# EAGLE design SSCI_SPI_LCD (EAGLE 7.5.0)
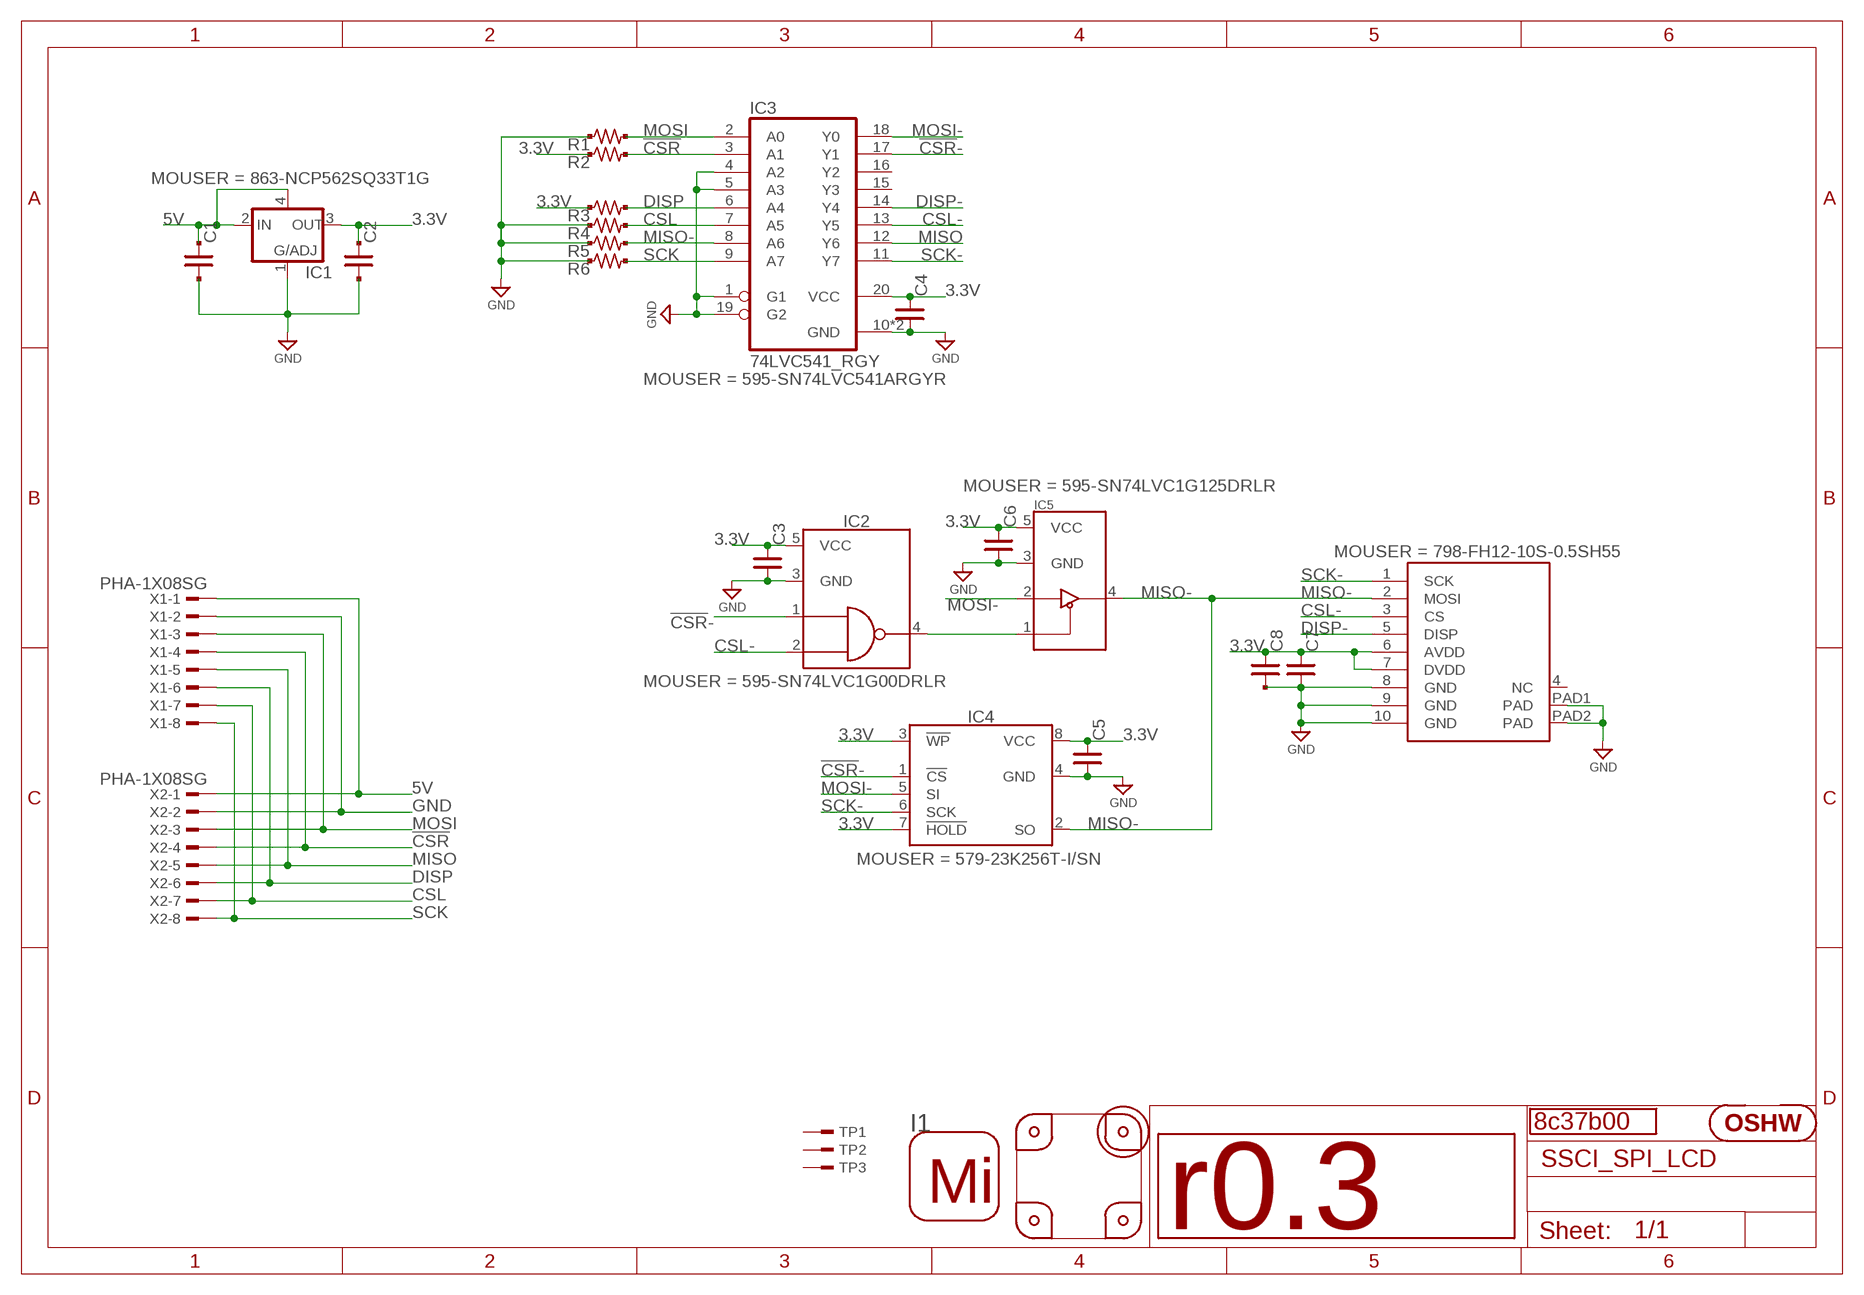
[diagram p0: schematic, sheet 1]

## Parts
C1  C_SMD_10U_1608  [CR_1608]
C2  C_SMD_10U_1608  [CR_1608]
C3  C_SMD_0.1U_1005  [C0402]
C4  C_SMD_0.1U_1005  [C0402]
C5  C_SMD_0.1U_1005  [C0402]
C6  C_SMD_0.1U_1005  [C0402]
C7  C_SMD_0.1U_1005  [C0402]
C8  C_SMD_0.1U_1005  [C0402]
GIT1  8c37b00  GIT-REVISION_1.2  [GIT-REVISION_1.2]
I1  ICON_MINLAB_5.2S  [ICON_MINLAB_5.2MM]
IC1  LDO4_3.3_SC82-AB  [SOT130P220X135-4N]
IC2  74LVC1G00_DRL  [SOT50P160X120-5N]
IC3  74LVC541_RGY  [QFN50P460X360-20N]
IC4  IC_MEMORY_8P_23K256-I_SOP  [IC_08_1.27_150MIL]
IC5  74LVC1G125_DRL  [SOT50P160X120-5N]
ICON1  r0.3  ICON_REVISION_1.7  [ICON_REVISION1.7]
ICON2  ICON_OSHW  [ICON_OSHW]
LCD1  LCD_GLCD_400X240  [LCD_GLCD_400X240]
P1  PCB_CORNER_NH  [PCB_CORNER_NH]
P2  PCB_CORNER_NH  [PCB_CORNER_NH]
P3  PCB_CORNER_NH  [PCB_CORNER_NH]
P4  PCB_CORNER_NH  [PCB_CORNER_NH]
R1  R_US_10K_1005  [C0402]
R2  R_US_10K_1005  [C0402]
R3  R_US_10K_1005  [C0402]
R4  R_US_10K_1005  [C0402]
R5  R_US_10K_1005  [C0402]
R6  R_US_10K_1005  [C0402]
TP1  TESTPAD_F  [FIDUCIAL]
TP2  TESTPAD_F  [FIDUCIAL]
TP3  TESTPAD_F  [FIDUCIAL]
X1  PHA-1X08SG  [PHA-1X08SG]
X2  PHA-1X08SG  [PHA-1X08SG]

## Nets
3.3V: C2.1 C3.1 C4.1 C5.1 C6.1 C7.1 C8.1 IC1.3(OUT) IC2.5(VCC) IC3.20(VCC) IC4.3(!WP) IC4.7(!HOLD) IC4.8(VCC) IC5.5(VCC) LCD1.6(AVDD) LCD1.7(DVDD) R2.1 R3.1
5V: C1.1 IC1.2(IN) IC1.4(OUT/EN/NC) X1.1 X2.1
!CSR!: IC3.3(A1) R2.2 X1.4 X2.4
!CSR!-: IC2.1(1A) IC3.17(Y1) IC4.1(!CS)
CSL: IC3.7(A5) R4.2 X1.7 X2.7
CSL-: IC2.2(1B) IC3.13(Y5) LCD1.3(CS)
DISP: IC3.6(A4) R3.2 X1.6 X2.6
DISP-: IC3.14(Y4) LCD1.5(DISP)
GND: C1.2 C2.2 C3.2 C4.2 C5.2 C6.2 C7.2 C8.2 IC1.1(ADJ) IC2.3(GND) IC3.1(G1) IC3.4(A2) IC3.5(A3) IC3.10(GND) IC3.19(G2) IC3.EP(GND) IC4.4(GND) IC5.3(GND) LCD1.8(GND) LCD1.9(GND) LCD1.10(GND) LCD1.PAD1(PAD) LCD1.PAD2(PAD) R1.1 R4.1 R5.1 R6.1 X1.2 X2.2
MISO: IC3.12(Y6) X1.5 X2.5
MISO-: IC3.8(A6) IC4.2(SO) IC5.4(Y) LCD1.2(MOSI) R5.2
MOSI: IC3.2(A0) R1.2 X1.3 X2.3
MOSI-: IC3.18(Y0) IC4.5(SI) IC5.2(A)
N$2: IC2.4(1Y) IC5.1(!OE!)
SCK: IC3.9(A7) R6.2 X1.8 X2.8
SCK-: IC3.11(Y7) IC4.6(SCK) LCD1.1(SCK)
Unconnected: IC3.15(Y3) IC3.16(Y2) LCD1.4(NC) TP1.TP TP2.TP TP3.TP

## Library data of the parts
C1 C2 = mylib:C_SMD_*: SMD CAPACITOR; DIGIKEY: 445-11238-1-ND; SMD_PAD: 2
C3-C8 = mylib:C_SMD_*: SMD CAPACITOR; DIGIKEY: 490-3261-1-ND; SEEED: 302010024; SMD_PAD: 2
GIT1 = git-revision:GIT-REVISION; NOT_COMPONENT: YES
I1 = mylib:ICON_MINLAB; NOT_COMPONENT: YES
IC1 = mylib:LDO4_*: LDO with 4 pins; MOUSER: 863-NCP562SQ33T1G
IC2 = mylib:74*1G00: SINGLE 2-INPUT POSITIVE-OR GATE; MOUSER: 595-SN74LVC1G00DRLR
IC3 = mylib:74*541; MOUSER: 595-SN74LVC541ARGYR
IC4 = mylib:IC_MEMORY_8P_*; DIGIKEY: 23K256T-I/SNCT-ND; MOUSER: 579-23K256T-I/SN
IC5 = mylib:74*1G125: SINGLE BUS BUFFER GATE w/ 3-State Output; MOUSER: 595-SN74LVC1G125DRLR
ICON1 = mylib:ICON_REVISION; NOT_COMPONENT: YES
ICON2 = mylib:ICON_OSHW: Silk icon of OSHW; NOT_COMPONENT: YES
LCD1 = mylib:LCD_GLCD_400X240; DIGIKEY: HFJ110CT-ND; MOUSER: 798-FH12-10S-0.5SH55
P1-P4 = mylib:PCB_CORNER; NOT_COMPONENT: YES
R1 = mylib:R_US_*: SMD resistor Packages : _1608 : 1.6 x 0.8 mm _2125 : 2.0 x 1.25 mm _3216 : 3.2 x 1.6 mm; DIGIKEY: P10.0KLCT-ND; NOT_COMPONENT: YES; SEEED: 301010047; SMD_PAD: 2
R2-R6 = mylib:R_US_*: SMD resistor Packages : _1608 : 1.6 x 0.8 mm _2125 : 2.0 x 1.25 mm _3216 : 3.2 x 1.6 mm; DIGIKEY: P10.0KLCT-ND; SEEED: 301010047; SMD_PAD: 2
TP1-TP3 = mylib:TESTPAD: test points; NOT_COMPONENT: YES
X1 X2 = mylib:PHA-1X08*G; AKIZUKI: C-04394

## Board
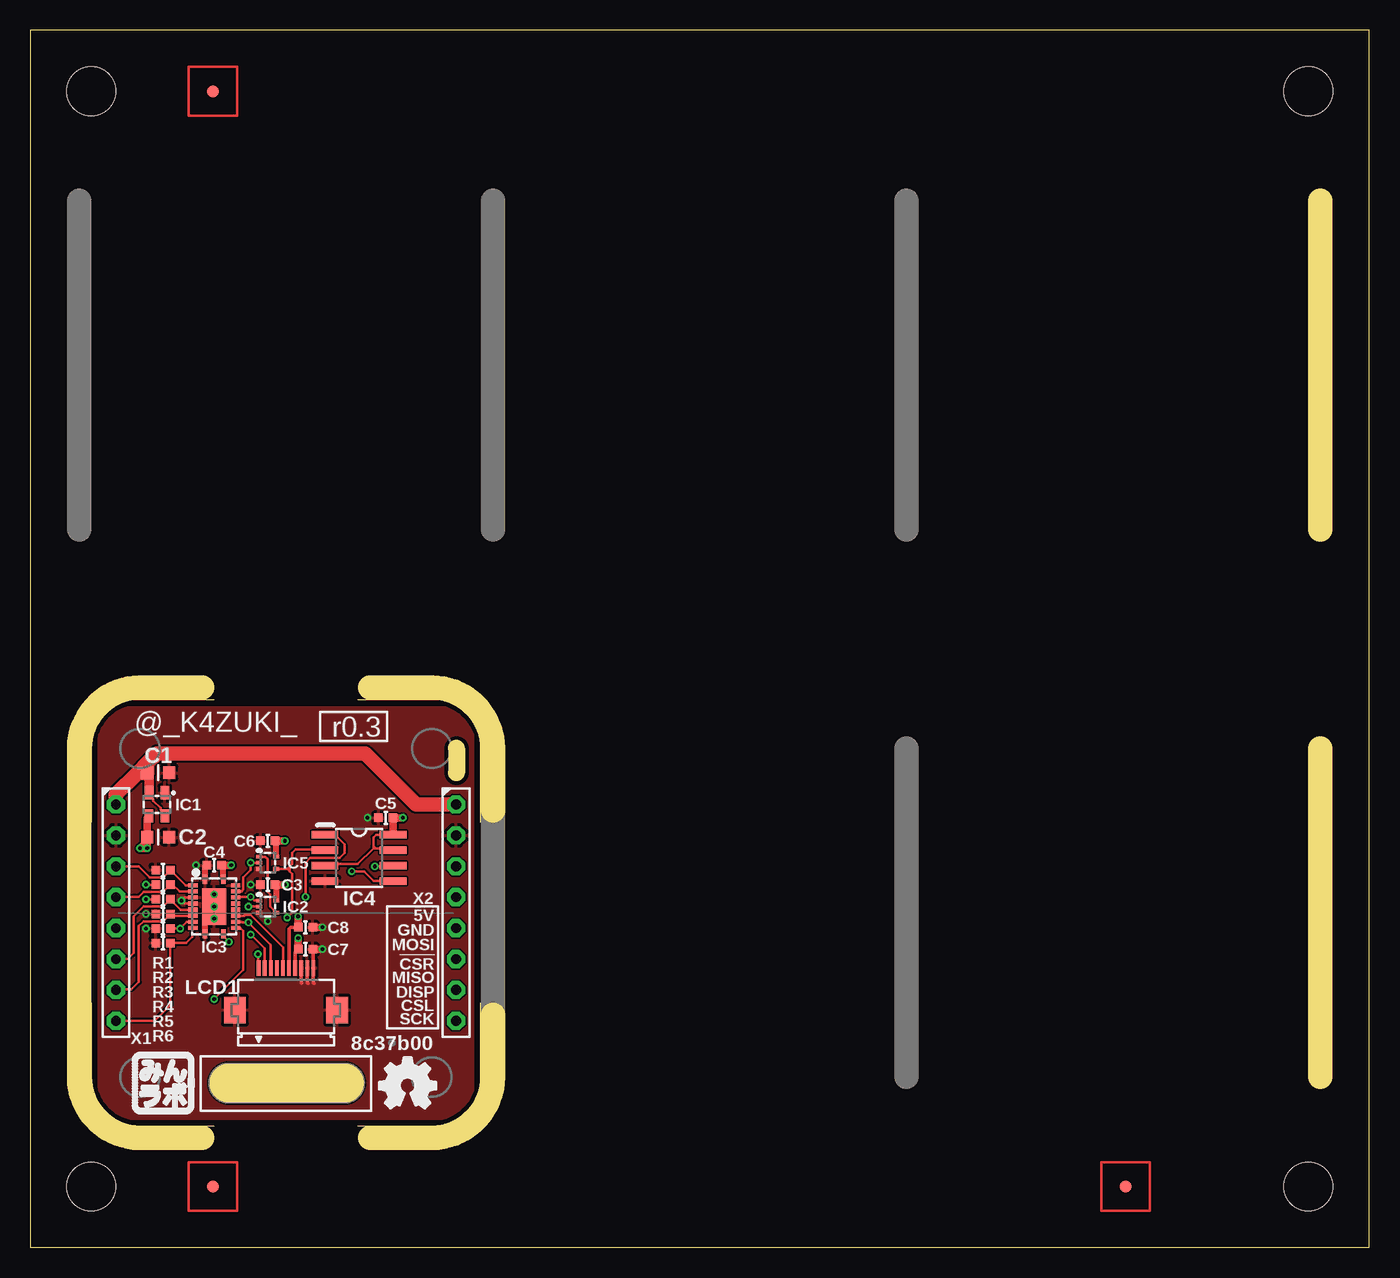
[diagram p1: board, top side]
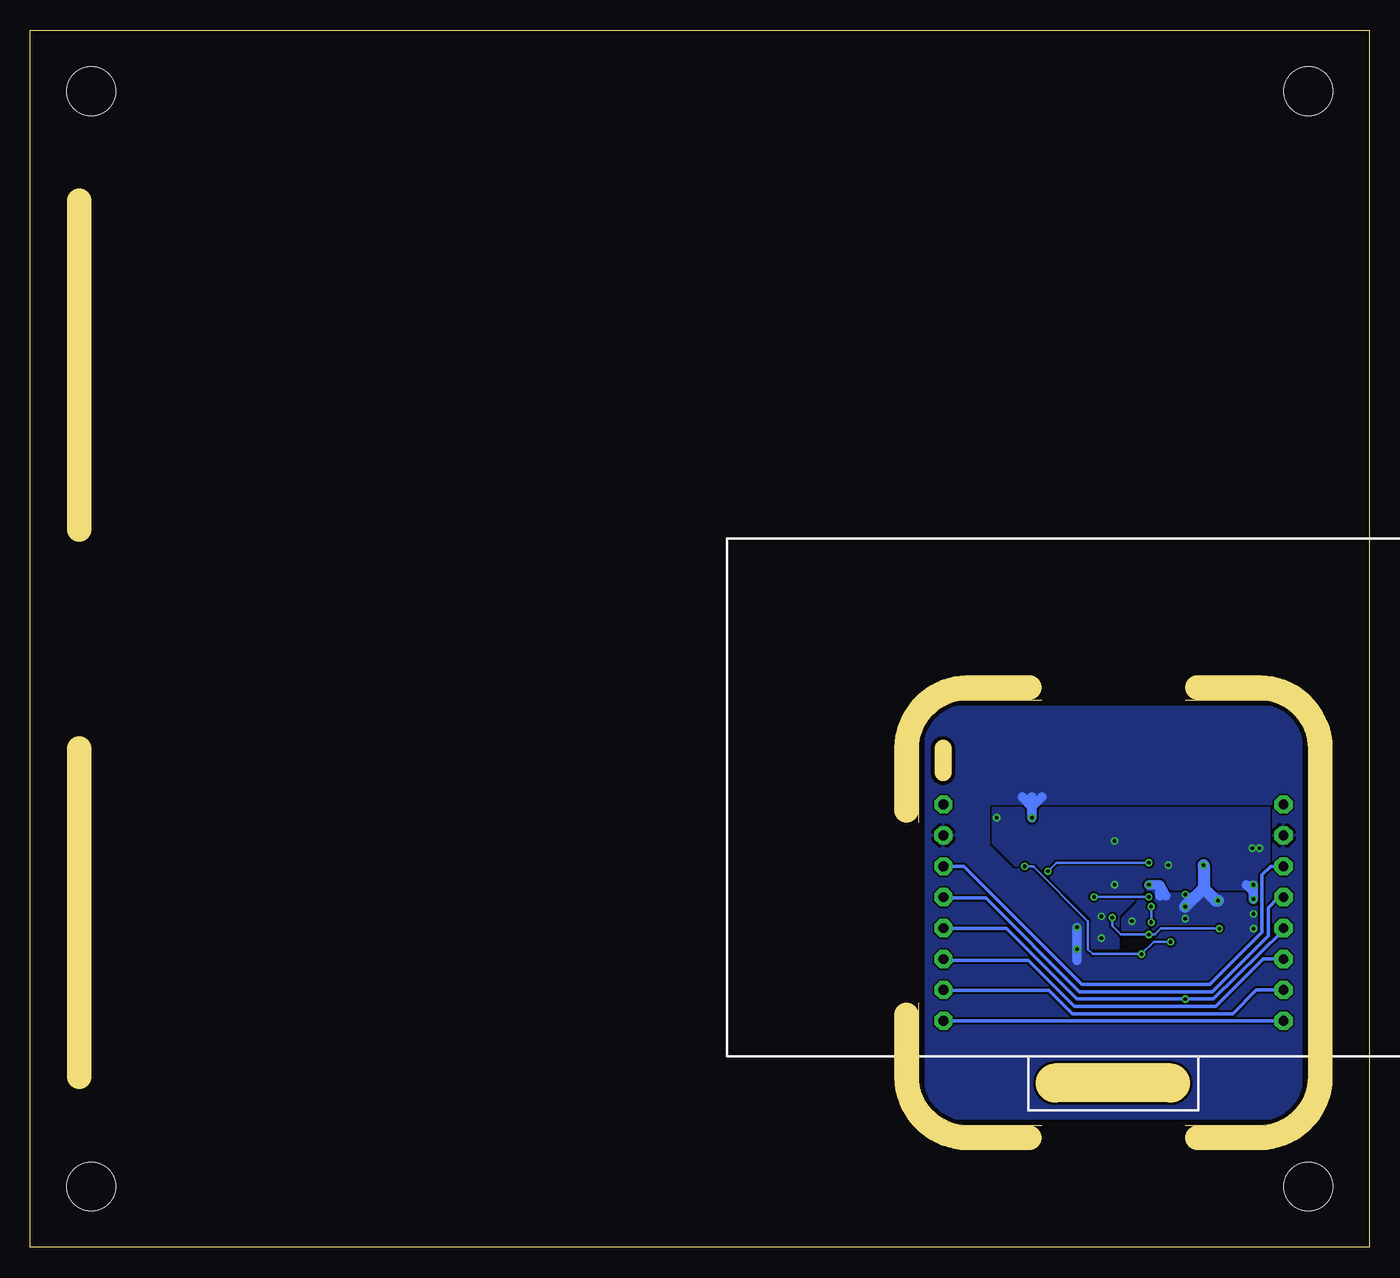
[diagram p2: board, bottom side, seen from below]

Size 110 x 100 mm. Coordinates in mm from the lower left corner, seen from the top.
Outline: 0,0 110,0 110,100 0,100 0,0
Copper layers (1*16): Top 0.035mm / dielectric 1.5mm / Bottom 0.035mm
Design rules "default": minimum track width 0.15mm, minimum drill 0.3mm, track to track 0.15mm, track to pad 0.15mm, pad to pad 0.15mm, via to via 0.15mm, smd to smd 0mil, copper to edge 0.4mm, drill to drill 8mil, minimum pad ring 0.15mm, minimum via ring 0.15mm, stop-mask expansion 4mil, vias tented up to drill 100mil, thermal gap 10mil
Holes 4 mm at 5,5 105,5 105,95 5,95
tRestrict: 18 lines
bRestrict: 5 lines
Milling: 4 lines

### Footprints (pad centres in the part's own frame; a part is rotated, then mirrored left to right if it is on the bottom)
CR_1608 = smd 1 x 1: 1 -0.9,0; 2 0.9,0
C0402 = smd 0.7 x 0.7: 1 -0.6,0; 2 0.6,0
SOT130P220X135-4N = smd 0.7 x 1.1: 1 -0.65,-0.95; 2 0.65,-0.95; 3 0.65,0.95; 4 -0.65,0.95
SOT50P160X120-5N = smd 0.3 x 0.5: 1 -0.5,-0.7; 2 0,-0.7; 3 0.5,-0.7; 4 0.5,0.7; 5 -0.5,0.7
QFN50P460X360-20N = smd 0.75 x 0.35: 1 -2.25,-0.75; 10 2.25,-0.75; 11 2.25,0.75; 20 -2.25,0.75 | smd 0.35 x 0.75: 2 -1.75,-1.75; 3 -1.25,-1.75; 4 -0.75,-1.75; 5 -0.25,-1.75; 6 0.25,-1.75; 7 0.75,-1.75; 8 1.25,-1.75; 9 1.75,-1.75; 12 1.75,1.75; 13 1.25,1.75; 14 0.75,1.75; 15 0.25,1.75; 16 -0.25,1.75; 17 -0.75,1.75; 18 -1.25,1.75; 19 -1.75,1.75 | smd 3 x 2: EP 0,0
IC_08_1.27_150MIL = smd 0.6 x 2.2: 1 -1.905,-2.8; 2 -0.635,-2.8; 3 0.635,-2.8; 4 1.905,-2.8; 5 1.905,2.8; 6 0.635,2.8; 7 -0.635,2.8 | smd 0.603 x 2.2: 8 -1.905,2.8
LCD_GLCD_400X240 = smd 0.3 x 1.3: 1 -2.25,3.45; 2 -1.75,3.45; 3 -1.25,3.45; 4 -0.75,3.45; 5 -0.25,3.45; 6 0.25,3.45; 7 0.75,3.45; 8 1.25,3.45; 9 1.75,3.45; 10 2.25,3.45 | smd 1.8 x 2.2: PAD1 4.2,0; PAD2 -4.2,0
FIDUCIAL = smd 1 x 1: TP 0,0
PHA-1X08SG = drill 0.8 pad 1.5 octagon: 1 8.89,0; 2 6.35,0; 3 3.81,0; 4 1.27,0; 5 -1.27,0; 6 -3.81,0; 7 -6.35,0; 8 -8.89,0

### Placement (x,y rotation side)
C1  10.5,39 0 top
C2  10.5,33.7 0 top
C3  19.5,29.8 180 top
C4  15.1,31.4 180 top
C5  29.2,35.3 180 top
C6  19.5,33.4 180 top
C7  22.6,24.5 0 top
C8  22.6,26.3 0 top
GIT1  29.7,16.8 0 top
I1  8.4,11 0 top
IC1  10.4,36.4 180 top
IC2  19.5,28 270 top
IC3  15.1,28 270 top
IC4  27,32 270 top
IC5  19.5,31.6 270 top
ICON1  26.9,42.8 0 top
ICON2  31,13.3 0 top
LCD1  21,19.5 0 top
P1  33,14 0 top
P2  33,41 90 top
P3  9,41 180 top
P4  9,14 270 top
R1  10.9,31 0 top
R2  10.9,29.8 0 top
R3  10.9,28.6 0 top
R4  10.9,27.4 0 top
R5  10.9,26.2 0 top
R6  10.9,25 0 top
TP1  15,5 0 top
TP2  90,5 0 top
TP3  15,95 0 top
X1  7.03,27.5 90 top
X2  34.97,27.5 90 top

### Tracks (layer width: path | path; a pad name or v marks a point on that pad's centre or on a via)
3.3V  (via drill 0.3)
  Top 0.2: 20.2,28.6 IC2.5 | 20.2,32.2 IC5.5 | IC4.7 28.96,32.63 28.8,32.8 28.4,32.8 | 28.4,32.8 28.2,32.8 | IC4.3 25.07,31.36 25.2,31.5 26.9,31.5 28.2,32.8 | IC4.8 28.41,33.91 28.2,33.7 28.2,33 | 28.2,33 28.2,32.8 | R2.1 v9.5,29.8 | 28.2,33 28.4,32.8 | v9.5,28.6 R3.1
  Top 0.3: LCD1.6 21.25,26.15 21.4,26.3 C8.1 | LCD1.7 21.75,24.25 C7.1
  Top 0.5: C3.1 20.2,29.7 20.2,28.6 | 20.2,32.2 20.2,33.3 C6.1 | IC3.20 15.85,31.25 C4.1
  Top 0.6: IC4.8 C5.1 v30.6,35.3 | v22,25.4 C7.1 | v22,27.2 C8.1 | v20.9,29.8 C3.1 | C6.1 v20.9,33.4 | C4.1 v16.5,31.4 | IC1.3 9.6,35.3 C2.1 9.6,33.4 | 9.6,33.4 v9.6,32.8 v9,32.8 9.6,33.4
  Bottom 0.8: v9.5,28.6 9.5,29.2 | 9.5,29.2 v9.5,29.8 | 9.5,29.2 10.1,29.8
  pour Bottom: 8.2,36.1 30.9,36.1 30.9,33.2 29.1,31.4 27.2,31.4 22.8,27 22.8,24.6 20.6,24.6 20.6,27.2 18.4,29.4 8.2,29.4
5V
  Top 0.2: IC1.2 9.75,37.15 10.1,36.8 10.1,36.7 10.7,36.1 10.7,36 11.05,35.65 IC1.4
  Top 0.6: 8.8,39 9.1,39 9.7,38.4
  Top 0.8: IC1.2 9.75,38.85 C1.1
  Top 1.2: 8.8,39 7,37.2 7,36.4 X1.1 | 8.8,39 C1.1 9.6,39.8 | 9.6,39.8 10.4,40.6 27.5,40.6 31.7,36.4 X2.1 | 8.8,39 9.6,39.8
!CSR!
  Top 0.2: IC3.3 12.25,29.25 11.7,29.8 R2.2 10.9,29.2 9.3,29.2 8.9,28.8 7.02,28.8 X1.4
  Bottom 0.3: X2.4 35.04,28.7 31.5,28.7 23.8,21 12.9,21 8.3,25.6 8.3,27.9 7.49,28.71 7.09,28.71 X1.4
!CSR!-  (via drill 0.3)
  Top 0.2: IC3.17 17.25,28.75 17.3,28.8 v18.1,28.8 18.4,28.5 IC2.1 | IC4.1 24.2,33.8 25.1,33.8 25.8,33.1 25.8,32.4 25.4,32 23,32 22.6,31.6 v22.6,28.8
  Bottom 0.2: v18.1,28.8 v22.6,28.8
CSL
  Top 0.2: IC3.7 11.65,27.25 R4.2 10.9,26.8 9.3,26.8 8.9,26.4 8.9,21.8 8.3,21.2 7.04,21.2 X1.7
  Bottom 0.3: X2.7 35,21.1 26.3,21.1 24.4,19.2 11.2,19.2 9.25,21.15 X1.7
CSL-  (via drill 0.3)
  Top 0.2: LCD1.3 19.75,24.85 v17.9,26.7 17.4,26.7 17.35,26.75 IC3.13 | IC2.2 v17.9,28
  Bottom 0.2: v17.9,28 v17.9,26.7
DISP
  Top 0.2: IC3.6 12.35,27.75 R3.2 10.9,28 9.3,28 8.5,27.2 8.5,24.2 8,23.7 7.1,23.7 X1.6
  Bottom 0.3: X2.6 35,23.6 28,23.6 24.2,19.8 12.6,19.8 8.71,23.69 X1.6
DISP-
  Top 0.2: LCD1.5 20.75,24.65 18.1,27.3 17.6,27.3 17.55,27.25 IC3.14
GND  (via drill 0.3)
  Top 0.2: IC3.4 12.65,28.75 v12.4,28.5 12.65,28.25 IC3.5
  Top 0.3: LCD1.8 22.25,21.75 22.3,21.7 | LCD1.9 22.75,21.75 22.8,21.7 | C7.2 23.25,24.45 LCD1.10 23.25,21.75 23.3,21.7
  Top 0.5: IC3.1 14.35,31.25 C4.2 | IC3.10 14.35,26.95 14.4,27 v15.1,27
  Top 0.6: v24,24.5 C7.2 | v24,26.3 C8.2
  Bottom 0.8: v18.1,29.8 17.2,29.8 | v24,26.3 v24,24.5 24,23.6 | 17.2,29.8 17.2,28.9 | 17.2,29.8 16.7,28.9 | 27.7,37 27.7,36.2 | 27.7,36.2 v27.7,35.3 | 27.7,36.2 26.9,37 | 27.7,36.2 28.5,37
  Bottom 1: v13.6,31.4 13.6,29.5 | 13.6,29.5 IC3.EP | 13.6,29.5 12.6,28.5 v12.4,28.5
  other vias: 19.5,26.8 9.5,26.2 9.5,27.4 15.1,28 15.1,29
  pour Top: 5,45 37,45 37,10 5,10
  pour Bottom (rank 2): 5,45 37,45 37,10 5,10
MISO  (via drill 0.3)
  Top 0.2: IC3.12 17.25,26.25 17.5,26 17.5,22.8 v15.1,20.4
  Bottom 0.3: X2.5 35,26.2 29.8,26.2 24,20.4 v15.1,20.4 12.8,20.4 7.1,26 6.97,26.13 X1.5
MISO-  (via drill 0.3)
  Top 0.2: IC3.8 12.85,26.75 v12.3,26.2 R5.2 | LCD1.2 19.25,24.55 v18.1,25.7 | IC4.2 23.36,32.63 23.3,32.7 21.8,32.7 21.5,32.4 21.5,31.5 21.3,31.3 | 21.3,31.3 21.1,31.1 | 21.1,31.1 21.3,30.9 | 21.3,30.9 21.5,30.7 21.5,27.5 v21.1,27.1 | IC5.4 21.1,31.1 | 21.3,31.3 21.3,30.9
  Bottom 0.2: v12.3,26.2 17.1,26.2 17.6,25.7 v18.1,25.7 20.4,25.7 21.1,26.4 v21.1,27.1
MOSI
  Top 0.2: IC3.2 12.75,29.75 R1.2 10.9,30.4 9.8,30.4 8.9,31.3 7.1,31.3 X1.3
  Bottom 0.3: X2.3 35,31.3 33.3,31.3 23.6,21.6 13.1,21.6 8.8,25.9 8.8,30.6 8.09,31.31 X1.3
MOSI-  (via drill 0.3)
  Top 0.2: IC3.18 17.35,29.25 17.5,29.4 17.5,30.4 18.1,31 v18.1,31.6 IC5.2 | IC4.5 28.2,30.1 27.4,30.9 v26.4,30.9
  Bottom 0.2: v18.1,31.6 25.7,31.6 v26.4,30.9
N$2
  Top 0.2: IC5.1 19.3,32.1 19.5,31.9 19.5,29.2 19.7,29 19.7,28 IC2.4
SCK
  Top 0.2: IC3.9 13.3,26.2 13.3,25.5 12.8,25 R6.2 11.5,19.9 10.2,18.6 7.1,18.6 X1.8
  Bottom 0.3: X2.8 35,18.6 7.1,18.6 X1.8
SCK-  (via drill 0.3)
  Top 0.2: IC3.11 15.9,25.7 15.9,25.5 v16.3,25.1 | LCD1.1 18.75,23.45 18.7,23.5 v18.7,24.1 | IC4.6 29.8,31.3 v28.3,31.3
  Bottom 0.2: v28.3,31.3 27.6,31.3 23.1,26.8 23.1,24.5 22.7,24.1 v18.7,24.1 17.7,25.1 v16.3,25.1

### Text on the board
tPlace: @_K4ZUKI_ | 5V | GND | MOSI | !CSR! | MISO | DISP | CSL | SCK